# Altium schematic sheet 02 BLOCK DIAGRAM.SchDoc
size 420 x 297 mm; Organization: Altium Limited; Address1: L3, 12a Rodborough Rd; Address2: Frenchs Forest; Address3: NSW; Address4: Australia 2086
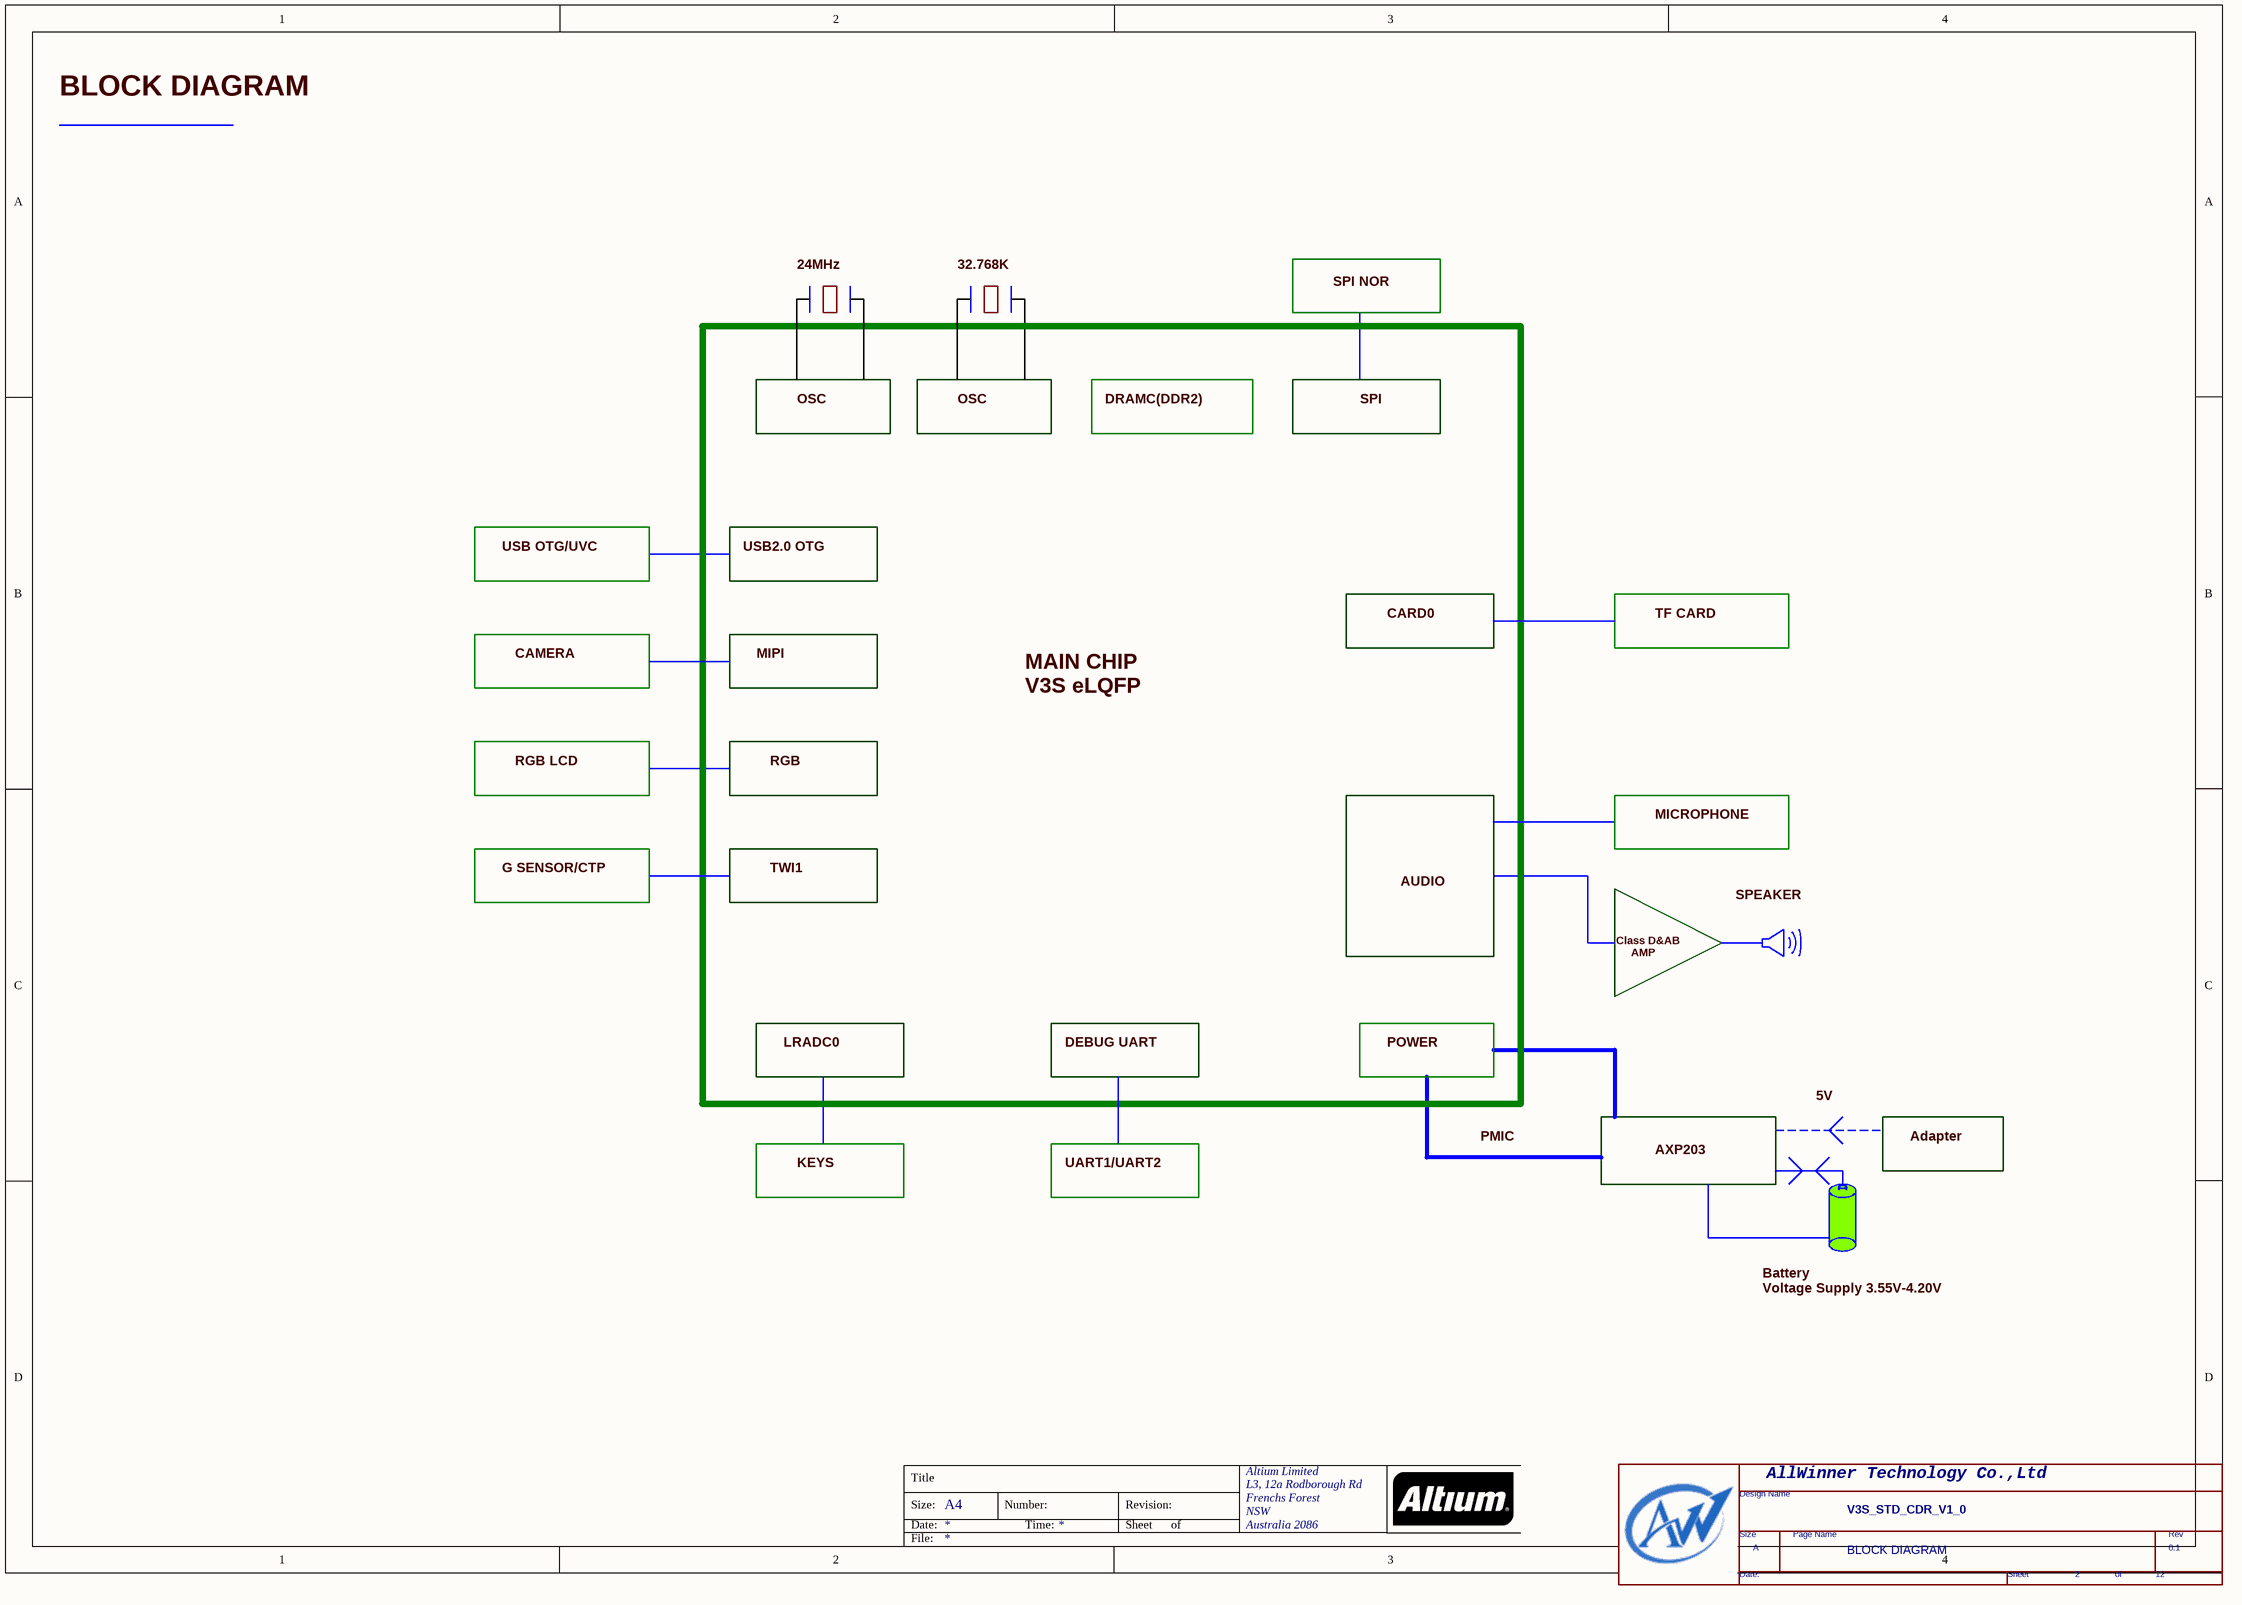
[diagram p0: 02 BLOCK DIAGRAM.SchDoc]

## Parts
*  Page Count: 12  Page Number: 2  Page Size: A  Title: V3S_STD_CDR_V1_0  RevCode: 0.1  Doc: BLOCK DIAGRAM  (hidden comment: TitleBlock0-AW)  (graphical)

## Notes on the sheet
- BLOCK DIAGRAM
- 24MHz
- 32.768K
- SPI NOR
- OSC
- DRAMC(DDR2)
- SPI
- USB OTG/UVC
- USB2.0 OTG
- CAMERA
- MIPI
- MAIN CHIP
  V3S eLQFP
- CARD0
- TF CARD
- RGB LCD
- RGB
- MICROPHONE
- G SENSOR/CTP
- TWI1
- AUDIO
- Class D&AB
  AMP
- SPEAKER
- LRADC0
- DEBUG UART
- POWER
- 5V
- KEYS
- UART1/UART2
- PMIC
- AXP203
- Adapter
- Battery
  Voltage Supply 3.55V-4.20V
- Title
- Size:
- Date:
- A4
- Number:
- Time:
- Revision:
- Sheet
- of
- File:
- (in symbol TitleBlock0-AW) AllWinner Technology Co.,Ltd; Design Name; Size; Page Name; Rev; Date:; Sheet; of

## Library data of the parts
* = TitleBlock0-AW: Page Create Date: March  8, 1995